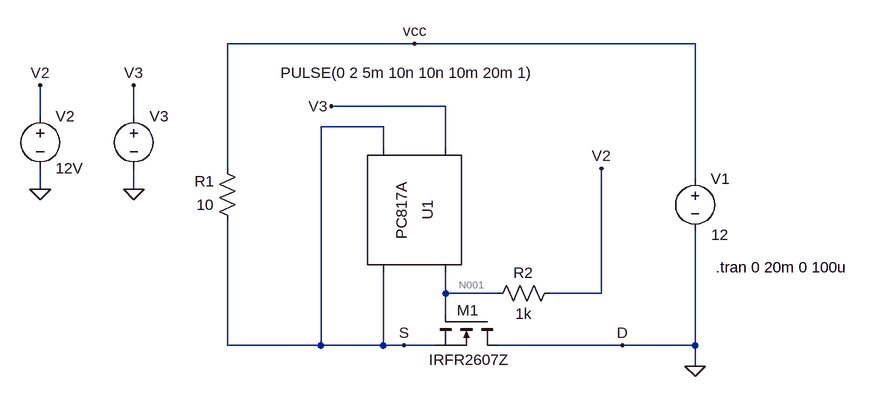
[diagram p0: schematic short_circuit_protection_version2.asc]
short_circuit_protection_version2.asc, the LTspice schematic file:
Version 4
SHEET 1 1064 680
WIRE 144 -16 -144 -16
WIRE 576 -16 144 -16
WIRE 192 80 16 80
WIRE -432 96 -432 48
WIRE -288 96 -288 48
WIRE 96 112 0 112
WIRE 96 144 96 112
WIRE 192 144 192 80
WIRE -144 176 -144 -16
WIRE 576 192 576 -16
WIRE -432 208 -432 176
WIRE -288 208 -288 176
WIRE 192 368 192 336
WIRE 272 368 192 368
WIRE 432 368 432 176
WIRE 432 368 352 368
WIRE 192 400 192 368
WIRE -144 448 -144 256
WIRE 0 448 0 112
WIRE 0 448 -144 448
WIRE 96 448 96 336
WIRE 96 448 0 448
WIRE 128 448 96 448
WIRE 176 448 128 448
WIRE 464 448 272 448
WIRE 576 448 576 272
WIRE 576 448 464 448
WIRE 576 480 576 448
FLAG -432 208 0
FLAG -432 48 V2
FLAG 432 176 V2
FLAG 576 480 0
FLAG 464 448 D
FLAG 144 -16 vcc
FLAG -288 208 0
FLAG -288 48 V3
FLAG 16 80 V3
FLAG 128 448 S
SYMBOL res -128 272 R180
WINDOW 0 36 76 Left 2
WINDOW 3 36 40 Left 2
SYMATTR InstName R1
SYMATTR Value 10
SYMBOL nmos 272 400 R90
WINDOW 0 -6 29 VRight 2
WINDOW 3 70 -20 VRight 2
SYMATTR InstName M1
SYMATTR Value IRFR2607Z
SYMBOL voltage -432 80 R0
SYMATTR InstName V2
SYMATTR Value 12V
SYMBOL res 368 352 R90
WINDOW 0 0 56 VBottom 2
WINDOW 3 32 56 VTop 2
SYMATTR InstName R2
SYMATTR Value 1k
SYMBOL voltage 576 176 R0
WINDOW 3 25 102 Left 2
WINDOW 123 0 0 Left 0
WINDOW 39 0 0 Left 0
SYMATTR Value 12
SYMATTR InstName V1
SYMBOL Optos\\PC817A 144 240 R90
SYMATTR InstName U1
SYMBOL voltage -288 80 R0
WINDOW 3 226 -51 Left 2
WINDOW 123 0 0 Left 0
WINDOW 39 0 0 Left 0
SYMATTR Value PULSE(0 2 5m 10n 10n 10m 20m 1)
SYMATTR InstName V3
TEXT 608 328 Left 2 !.tran 0 20m 0 100u

The netlist it stands for:
* short_circuit_protection_version2.asc
R1 S vcc 10
M1 0 N001 S S IRFR2607Z
V2 V2 0 12V
R2 V2 N001 1k
V1 vcc 0 12
XU1 V3 S N001 S PC817 Igain=1m
V3 V3 0 PULSE(0 2 5m 10n 10n 10m 20m 1)
.model NMOS NMOS
.model PMOS PMOS
.lib standard.mos
.tran 0 20m 0 100u
.lib PC817.sub
.backanno
.end

* Results of the author's LTspice run, read from the files saved beside the schematic
* Operating Point, zero values left out:
*   V(s) = 17.59 mV
*   V(vcc) = 12 V
*   V(n001) = 12 V
*   V(v2) = 12 V
*   Id(M1) = -1.198 A
*   Is(M1) = 1.198 A
*   I(R1) = -1.198 A
*   I(R2) = 48.78 pA
*   I(V2) = -48.78 pA
*   I(V1) = -1.198 A
*   Ix(u1:3) = 48.78 pA
*   Ix(u1:4) = -36.8 pA
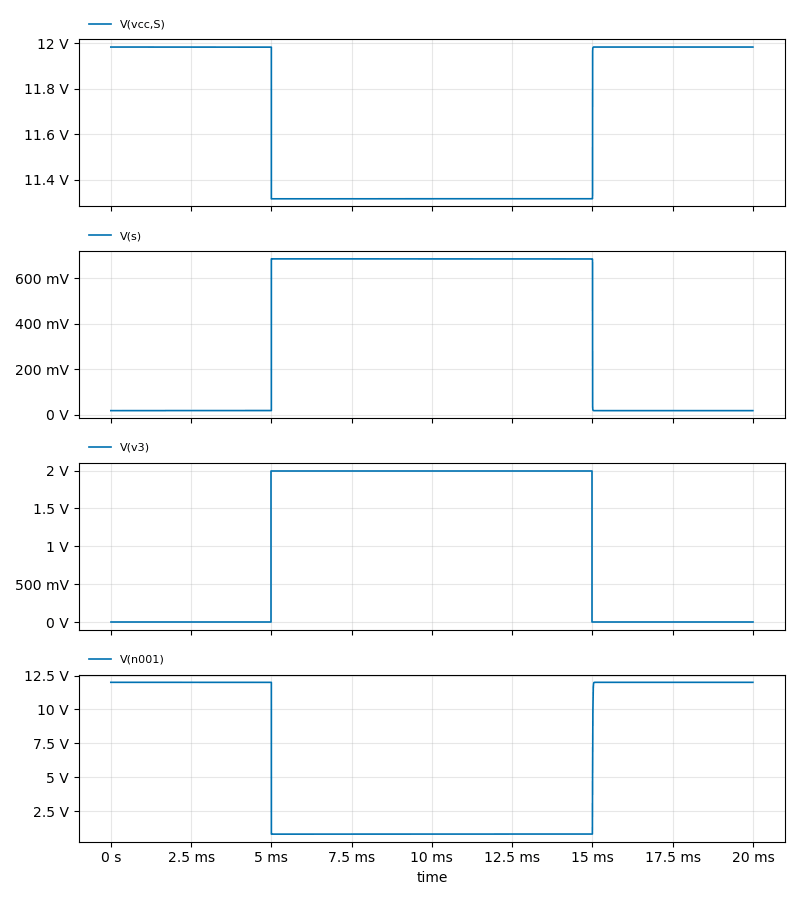
[diagram p1: Transient Analysis of short_circuit_protection_version2.asc, plotted from the saved traces]
* Transient Analysis, 1 run:
*   V(vcc,S): min 11.31 V, max 11.98 V, average 11.65 V, rms 11.65 V, last 11.98 V
*   V(s): min 17.59 mV, max 685 mV, average 351.3 mV, rms 484.4 mV, last 17.59 mV
*   V(v3): min 0 V, max 2 V, average 1 V, rms 1.414 V, last 0 V
*   V(n001): min 807.5 mV, max 12 V, average 6.398 V, rms 8.499 V, last 12 V